# Altium schematic sheet SlimPower.SchDoc
size A; SheetNumber: 3; SheetTotal: 3
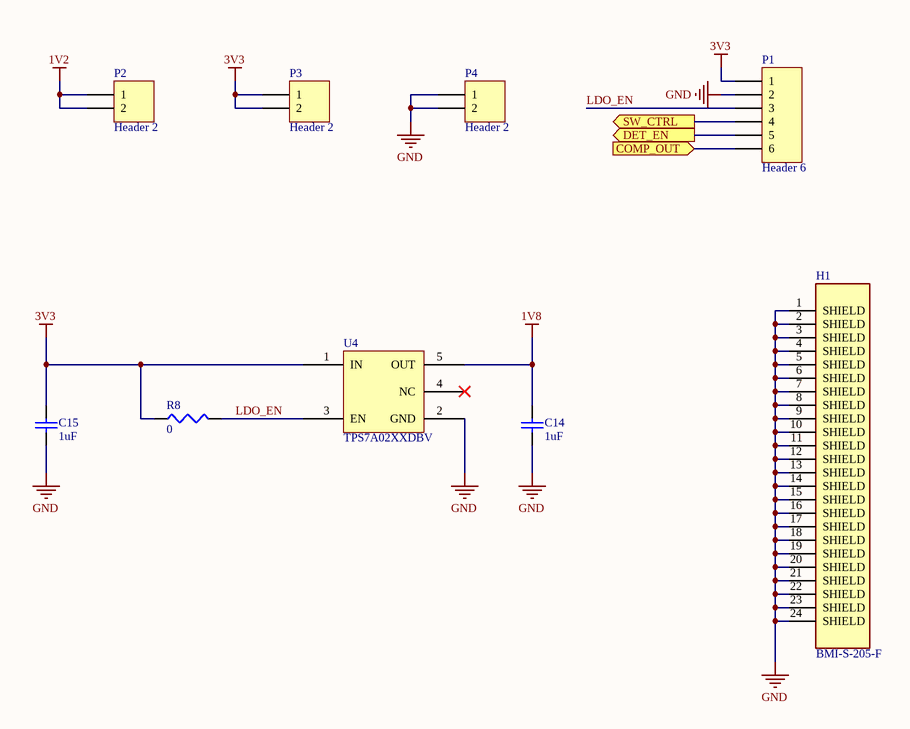
[diagram p0: SlimPower.SchDoc]

## Parts
C14  1uF  [SMD-0603]
C15  1uF  [SMD-0603]
H1  BMI-S-205-F  [LAIRD_BMI-S-205-F]
P1  Header 6  [HDR1X6]
P2  Header 2  [HDR1X2]
P3  Header 2  [HDR1X2]
P4  Header 2  [HDR1X2]
R8  0  [SMD-0603]
U4  TPS7A02XXDBV  [SOT95P280X145-5N]

## Ports
COMP_OUT (in), DET_EN (out), SW_CTRL (out)

## Nets
1V2: P2.1 P2.2
1V8: C14.2 U4.5(OUT)
3V3: C15.2 P1.1 P3.1 P3.2 R8.1 U4.1(IN)
GND: C14.1 C15.1 H1.1(SHIELD) H1.2(SHIELD) H1.3(SHIELD) H1.4(SHIELD) H1.5(SHIELD) H1.6(SHIELD) H1.7(SHIELD) H1.8(SHIELD) H1.9(SHIELD) H1.10(SHIELD) H1.11(SHIELD) H1.12(SHIELD) H1.13(SHIELD) H1.14(SHIELD) H1.15(SHIELD) H1.16(SHIELD) H1.17(SHIELD) H1.18(SHIELD) H1.19(SHIELD) H1.20(SHIELD) H1.21(SHIELD) H1.22(SHIELD) H1.23(SHIELD) H1.24(SHIELD) P1.2 P4.1 P4.2 U4.2(GND)
COMP_OUT: P1.6 ; port COMP_OUT
DET_EN: P1.5 ; port DET_EN
LDO_EN: P1.3 R8.2 U4.3(EN)
SW_CTRL: P1.4 ; port SW_CTRL

Not connected (* = marked no-connect by the designer): U4 4(NC)*

## Library data of the parts
C14 C15 = CAP0603: Ceramic Capacitor 0603
H1 = BMI-S-205-F: RF Shield Frame 1.000 _25.40mm_ X 1.500 _38.10mm_ Solder; MF: Laird Technologies; Price: None; SnapEDA_Link: https://www.snapeda.com/parts/BMI-S-205-F/Laird%20Technologies%20EMI/view-part/596236/?ref=snap; Package: TSSOP-14 Laird; Availability: Unavailable; Value: *; MP: BMI-S-205-F
P1 = Header 6: Header, 6-Pin; LatestRevisionDate: 17-Jul-2002; LatestRevisionNote: Re-released for DXP Platform.; Publisher: Altium Limited
P2-P4 = Header 2: Header, 2-Pin; LatestRevisionDate: 17-Jul-2002; LatestRevisionNote: Re-released for DXP Platform.; Publisher: Altium Limited
R8 = RES0603: Resistor-0603
U4 = TPS7A02XXDBV: TPS7A02 Nanopower IQ, 25-nA, 200-mA, Low-Dropout Voltage Regulator With Fast / Transient Response